# Altium schematic sheet TLV70237DBVR1_TLV70237DBVR.schdoc.schdoc
size 124 x 101 mm
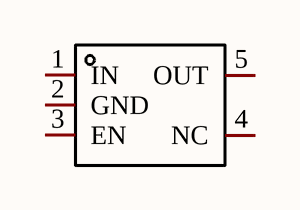
[diagram p0: TLV70237DBVR1_TLV70237DBVR.schdoc.schdoc]

## Parts
U?  TLV70237DBVR  [SOT-23-5_L2.9-W1.6-P0.95-LS2.8-BR]  (value not drawn)

## Nets

Not connected (* = marked no-connect by the designer): U? 1(IN) 2(GND) 3(EN) 4(NC) 5(OUT)

## Library data of the parts
U? = TLV70237DBVR: Manufacturer: TI(德州仪器); Add into BOM: yes; Symbol: TLV70237DBVR; Device: TLV70237DBVR; LCSC Part Name: TLV70237DBVR; Supplier Part: C2877850; Manufacturer Part: TLV70237DBVR; Supplier Footprint: SOT-23-5; JLCPCB Part Class: Extended Part; Supplier: LCSC; Convert to PCB: yes